# EasyEDA schematic C4F7N_MainBoard.json
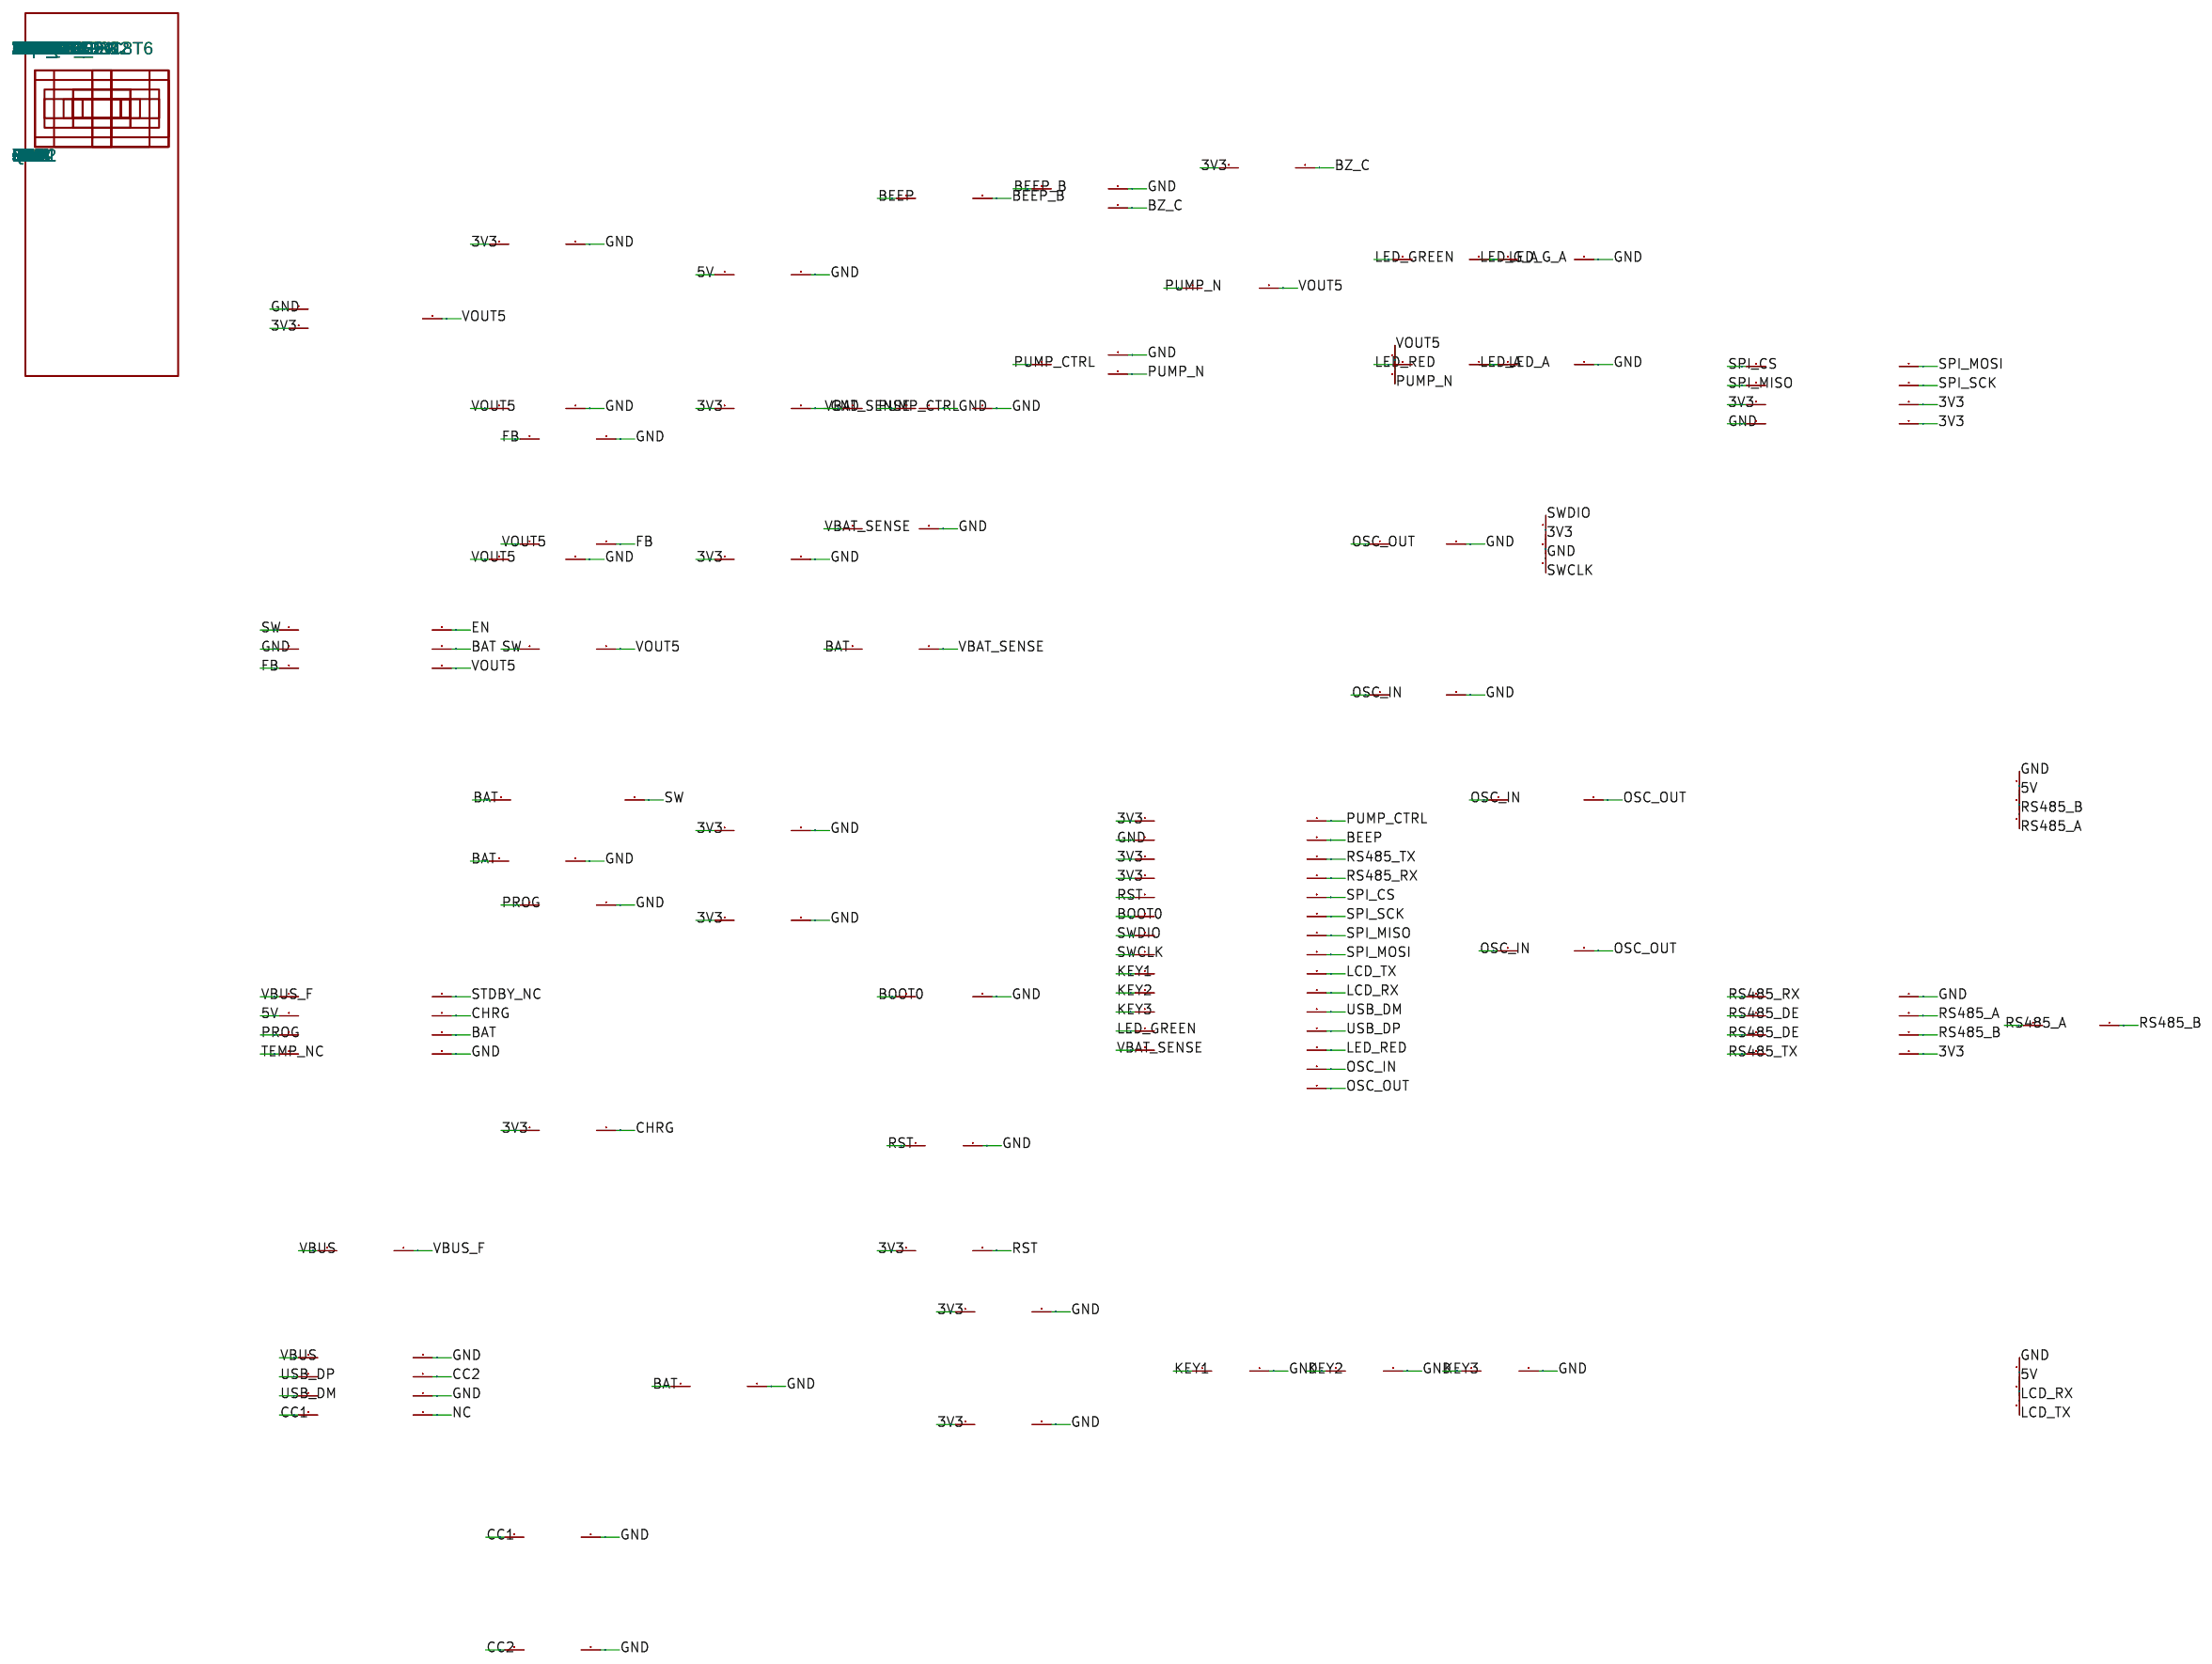
[diagram p0: schematic sheet]

## Parts
BT1  18650x2
BZ1  BUZZER_5V
C1  10uF
C2  22uF
C3  10uF
C4  10uF
C5  100nF
C6  100nF
C7  20pF
C8  20pF
C9  100nF
C10  100nF
C11  100nF
C12  100nF
C13  100nF
C14  100nF
D1  LED_RED
D2  SS34
D3  1N5819
F1  500mA
J1  USB-C
J2  LCD_4.3
J3  PROBE_GX12
J4  PUMP
J6  SWD
L1  10uH
LED1  LED_RED
LED2  LED_GREEN
Q1  SI2302
Q2  MMBT2222
R1  1.2k
R2  100k
R3  20k
R4  1M
R5  10k
R6  10k
R9  120R
R12  5.1k
R13  5.1k
R15  100k
R16  1k
R17  330R
R18  330R
R22  100k
R23  100k
SW1  RESET
SW2  KEY1
SW3  KEY2
SW4  KEY3
U1  TP4056
U2  MT3608
U3  AMS1117-3.3
U4  STM32F103C8T6
U5  MAX3485
U6  W25Q16
Y1  8MHz

## Library data of the parts
BT1 = -: : package; Battery_Holder: Contributor; LCEDA_Lib: spicePre; B: spiceSymbolName
BZ1 = -: : package; Buzzer_12x9.5RM7.6: Contributor; LCEDA_Lib: spicePre; B: spiceSymbolName
C1-C4 = -: : package; C_0805_2012Metric: Contributor; LCEDA_Lib: spicePre
C5-C14 = -: : package; C_0603_1608Metric: Contributor; LCEDA_Lib: spicePre
D1 = -: : package; LED_0805_2012Metric: Contributor; LCEDA_Lib: spicePre; D: spiceSymbolName
D2 D3 = -: : package; D_SMA: Contributor; LCEDA_Lib: spicePre; D: spiceSymbolName
F1 = -: : package; Fuse_0805_2012Metric: Contributor; LCEDA_Lib: spicePre; F: spiceSymbolName
J1 = -: : package; USB_C_Receptacle_HRO_TYPE-C-31-M-12: Contributor; LCEDA_Lib: spicePre; J: spiceSymbolName
J2 J3 J6 = -: : package; PinHeader_1x04_P2.54mm_Vertical: Contributor; LCEDA_Lib: spicePre; J: spiceSymbolName
J4 = -: : package; PinHeader_1x02_P2.54mm_Vertical: Contributor; LCEDA_Lib: spicePre; J: spiceSymbolName
L1 = -: : package; L_0805_2012Metric: Contributor; LCEDA_Lib: spicePre
LED1 LED2 = -: : package; LED_0805_2012Metric: Contributor; LCEDA_Lib: spicePre; L: spiceSymbolName
Q1 Q2 = -: : package; SOT-23: Contributor; LCEDA_Lib: spicePre; Q: spiceSymbolName
R1-R6 R9 R12 R13 R15-R18 R22 R23 = -: : package; R_0603_1608Metric: Contributor; LCEDA_Lib: spicePre
SW1-SW4 = -: : package; SW_Push_6x6mm: Contributor; LCEDA_Lib: spicePre; S: spiceSymbolName
U1 = -: : package; SOP-8_3.9x4.9mm_P1.27mm: Contributor; LCEDA_Lib: spicePre; U: spiceSymbolName
U2 = -: : package; SOT-23-6: Contributor; LCEDA_Lib: spicePre; U: spiceSymbolName
U3 = -: : package; SOT-223-3: Contributor; LCEDA_Lib: spicePre; U: spiceSymbolName
U4 = -: : package; LQFP-48_7x7mm_P0.5mm: Contributor; LCEDA_Lib: spicePre; U: spiceSymbolName
U5 U6 = -: : package; SOIC-8_3.9x4.9mm_P1.27mm: Contributor; LCEDA_Lib: spicePre; U: spiceSymbolName
Y1 = -: : package; Crystal_SMD_3215-4Pin: Contributor; LCEDA_Lib: spicePre; Y: spiceSymbolName

## Nets
3V3: J2.2 J3.2 J6.2
PUMP_N: J4.2

Not connected (* = marked no-connect by the designer): BT1 2; BZ1 2; C1 2; C2 2; C3 2; C4 2; C5 2; C6 2; C7 2; C8 2; C9 2; C10 2; C11 2; C12 2; C13 2; C14 2; D1 2; D2 2; D3 2; F1 2; J1 2; L1 2; LED1 2; LED2 2; Q1 2; Q2 2; R1 2; R2 2; R3 2; R4 2; R5 2; R6 2; R9 2; R12 2; R13 2; R15 2; R16 2; R17 2; R18 2; R22 2; R23 2; SW1 2; SW2 2; SW3 2; SW4 2; U1 2; U2 2; U3 2; U4 2; U5 2; U6 2; Y1 2
